# EAGLE design PowerScope_004 (EAGLE 6.1)
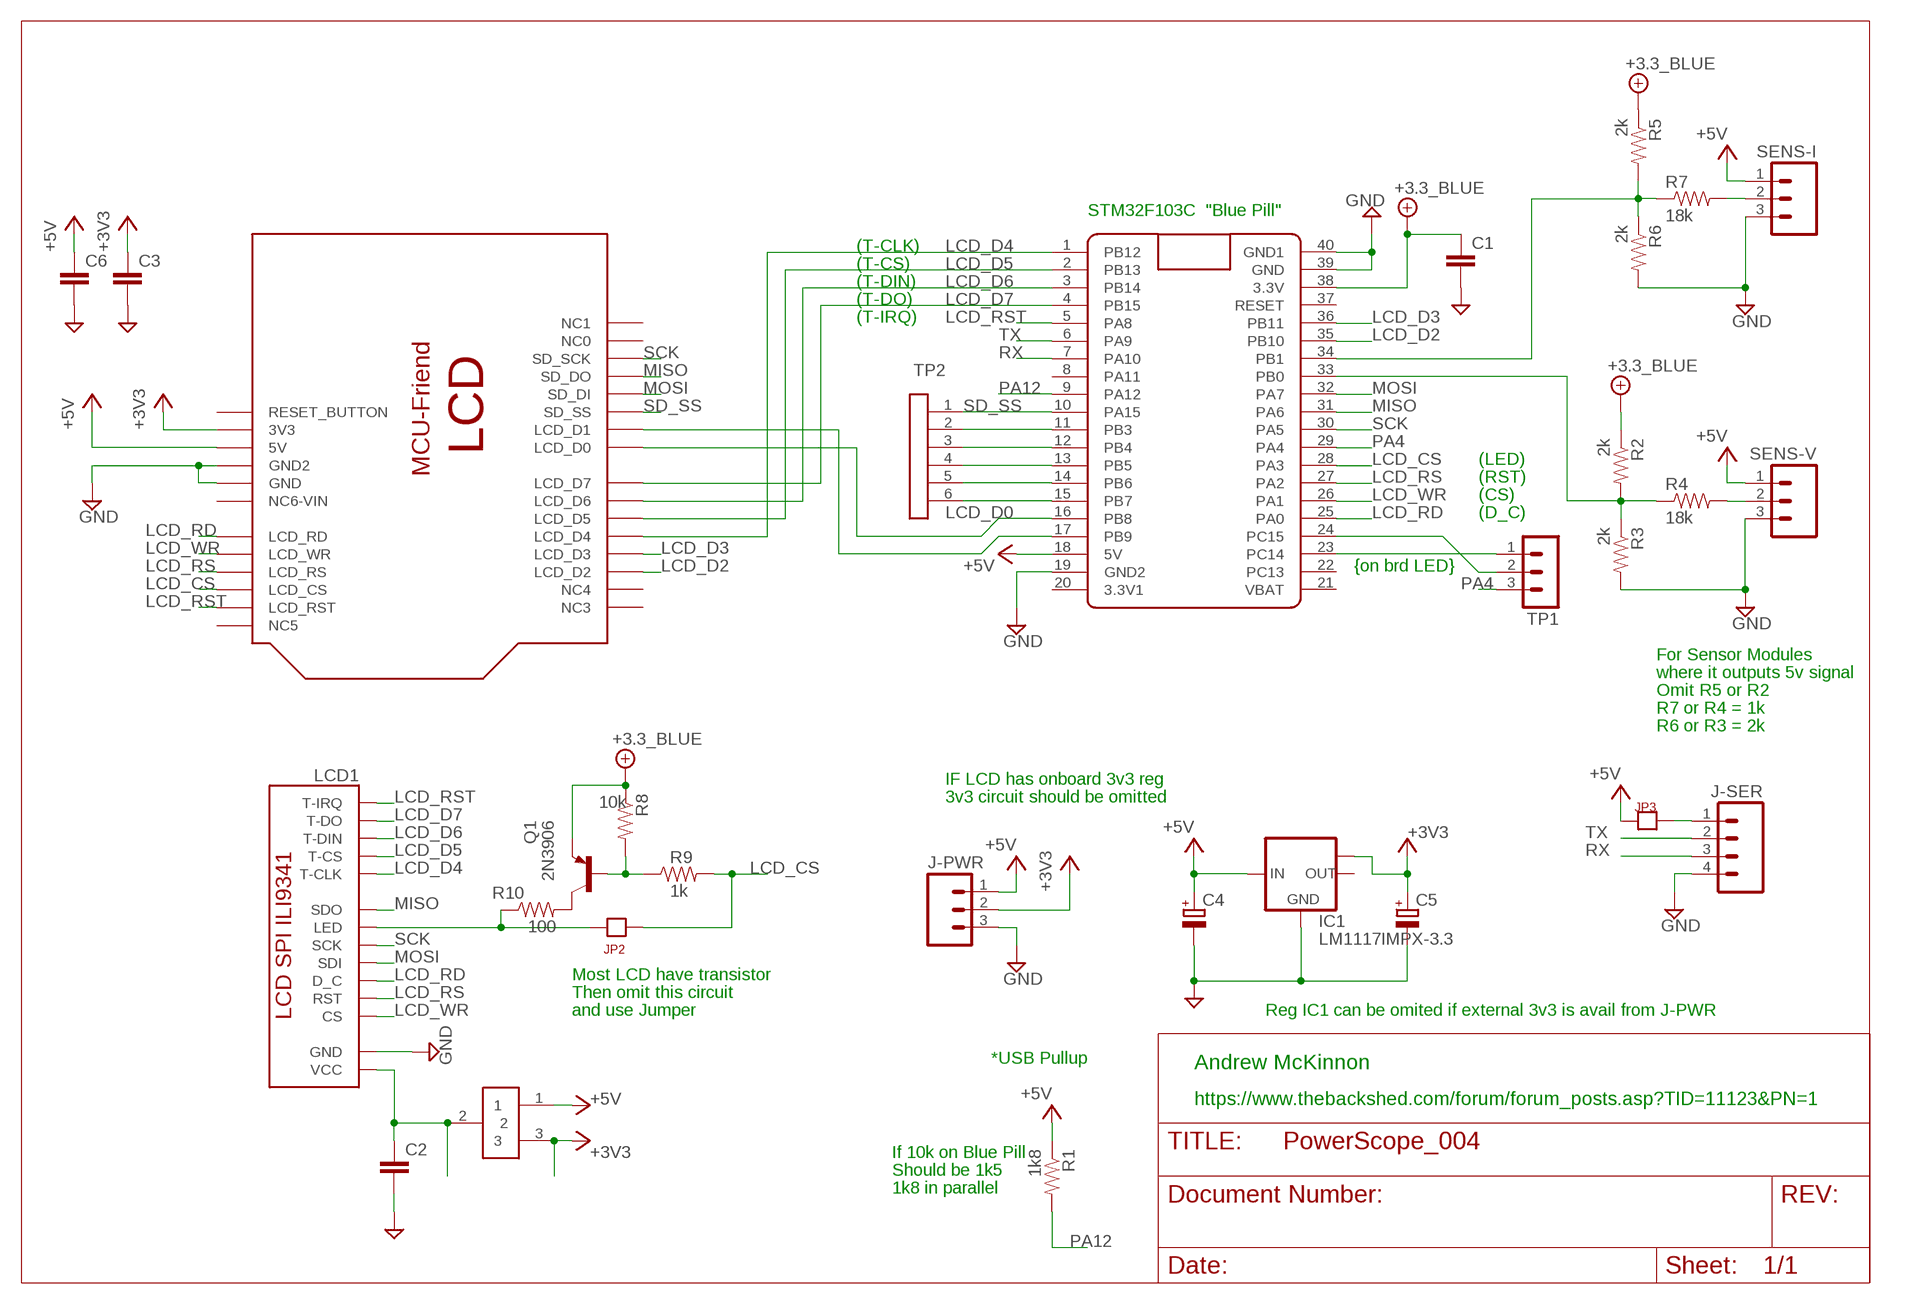
[diagram p0: schematic, sheet 1]

## Parts
C1  BCAP  [BCAP]
C2  BCAP  [BCAP]
C3  BCAP  [BCAP]
C4  C-RB200100  [CPOL-RADIAL-10UF-25V]
C5  C-RB200100  [CPOL-RADIAL-10UF-25V]
C6  BCAP  [BCAP]
IC1  LM1117IMPX-3.3  [SOT223]
J-PWR  MO3POL  [MOLEX-3]
J-SER  MO4POL  [MOLEX-4]
JP1  JP1X3  [JP1X3]
JP2  JP1  [JP1]
JP3  JP1  [JP1]
LCD1  LCD_ILI9341_SPI_TREV  [LCD_ILI9341_SPI_24T_REVERSE]
Q1  2N3906  [TO92]
R1  1k8  R4SMALLPAD  [R4_SP]
R2  2k  R4SMALLPAD  [R4_SP]
R3  2k  R4SMALLPAD  [R4_SP]
R4  18k  R4SMALLPAD  [R4_SP]
R5  2k  R4SMALLPAD  [R4_SP]
R6  2k  R4SMALLPAD  [R4_SP]
R7  18k  R4SMALLPAD  [R4_SP]
R8  10k  R4SMALLPAD  [R4_SP]
R9  1k  R4SMALLPAD  [R4_SP]
R10  100  R4SMALLPAD  [R4_SP]
SENS-I  MO3POL  [MOLEX-3]
SENS-V  MO3POL  [MOLEX-3]
TP1  MA03-1  [MA03-1]
TP2  SIL-6  [SIL6]
U$2  LCD_MCUFRIENDREV  [LCD-MCUFRIEND-24T-REV]
U$3  BLUE_PILL  [BLUE_PILL_CLEAN]

## Nets
+3V3: C3.1 C5.1(+) IC1.TAB(OUT1) J-PWR.2 JP1.3 U$2.3V(3V3)
+5V: C4.1(+) C6.1 IC1.3(IN) J-PWR.1 JP1.1 JP3.1 R1.P$1 SENS-I.1 SENS-V.1 U$2.5V U$3.18(5V)
+UB: C1.1 Q1.3(E) R2.P$1 R5.P$1 R8.P$1 U$3.38(3.3V) ; supply symbol labelled +3.3_BLUE
GND: C1.2 C2.2 C3.2 C4.2(-) C5.2(-) C6.2 IC1.1(GND) J-PWR.3 J-SER.4 LCD1.GND R3.P$2 R6.P$2 SENS-I.3 SENS-V.3 U$2.GND U$2.GND2 U$3.19(GND2) U$3.39(GND) U$3.40(GND1)
LCD_CS: JP2.2 R9.P$2 U$2.LCD_CS U$3.28(PA3)
LCD_D0: U$2.LCD_D0 U$3.16(PB8)
LCD_D2: U$2.LCD_D2 U$3.35(PB10)
LCD_D3: U$2.LCD_D3 U$3.36(PB11)
LCD_D4: LCD1.T_CLK(T-CLK) U$2.LCD_D4 U$3.1(PB12)
LCD_D5: LCD1.T_CS(T-CS) U$2.LCD_D5 U$3.2(PB13)
LCD_D6: LCD1.T_DI(T-DIN) U$2.LCD_D6 U$3.3(PB14)
LCD_D7: LCD1.T_DO(T-DO) U$2.LCD_D7 U$3.4(PB15)
LCD_RD: LCD1.D_C U$2.LCD_RD U$3.25(PA0)
LCD_RS: LCD1.RST U$2.LCD_RS U$3.27(PA2)
LCD_RST: LCD1.T-IRQ U$2.LCD_RST U$3.5(PA8)
LCD_WR: LCD1.CS U$2.LCD_WR U$3.26(PA1)
MISO: LCD1.SDO U$2.SD_DO U$3.31(PA6)
MOSI: LCD1.SDI U$2.SD_DI U$3.32(PA7)
N$1: Q1.2(B) R8.P$2 R9.P$1
N$2: U$2.LCD_D1 U$3.17(PB9)
N$3: Q1.1(C) R10.P$2
N$4: TP1.2 U$3.24(PC15)
N$5: TP2.6 U$3.15(PB7)
N$6: J-SER.1 JP3.2
N$7: R4.P$2 SENS-V.2
N$8: R2.P$2 R3.P$1 R4.P$1 U$3.33(PB0)
N$9: R7.P$2 SENS-I.2
N$10: R5.P$2 R6.P$1 R7.P$1 U$3.34(PB1)
N$11: TP1.1 U$3.23(PC14)
N$12: TP2.5 U$3.14(PB6)
N$13: TP2.4 U$3.13(PB5)
N$14: TP2.3 U$3.12(PB4)
N$15: TP2.2 U$3.11(PB3)
N$16: JP2.1 LCD1.LED R10.P$1
N$17: C2.1 JP1.2 LCD1.VCC
PA4: TP1.3 U$3.29(PA4)
PA12: R1.P$2 U$3.9(PA12)
RX: J-SER.3 U$3.7(PA10)
SCK: LCD1.SCK U$2.SD_SCK U$3.30(PA5)
SD_SS: TP2.1 U$2.SD_SS U$3.10(PA15)
TX: J-SER.2 U$3.6(PA9)
Unconnected: IC1.2(OUT) U$2.NC0 U$2.NC2(NC1) U$2.NC3 U$2.NC4 U$2.NC5 U$2.RESET_BUTTON U$2.VIN(NC6-VIN) U$3.8(PA11) U$3.20(3.3V1) U$3.21(VBAT) U$3.22(PC13) U$3.37(RESET)

## Notes on the sheet
- STM32F103C  "Blue Pill"
- (T-CLK)
- (T-CS)
- (T-DIN)
- (T-DO)
- (T-IRQ)
- (LED)
- (RST)
- (CS)
- (D_C)
- {on brd LED}
- For Sensor Modules
- where it outputs 5v signal
- Omit R5 or R2
- R7 or R4 = 1k
- R6 or R3 = 2k
- IF LCD has onboard 3v3 reg
- 3v3 circuit should be omitted
- Most LCD have transistor
- Then omit this circuit
- and use Jumper | Reg IC1 can be omited if external 3v3 is avail from J-PWR
- *USB Pullup
- Andrew McKinnon
- https://www.thebackshed.com/forum/forum_posts.asp?TID=11123&PN=1
- If 10k on Blue Pill
- Should be 1k5
- 1k8 in parallel

## Library data of the parts
C1-C3 C6 = Andrew Misc:BCAP
C4 C5 = Andrew:C-RB200100
IC1 = lm1117:LM1117IMPX-*
J-PWR SENS-I SENS-V = Andrew_Connectors:MO3POL
J-SER = Andrew_Connectors:MO4POL
JP1 = Andrew_Connectors:JP1X3
JP2 JP3 = Andrew_Connectors:JP1
LCD1 = Andrew_BluePill_Scope:LCD_ILI9341_SPI_T
Q1 = transistor-pnp:2N3906: PNP Transistor
R1-R10 = Andrew Misc:R4
TP1 = con-lstb:MA03-1: PIN HEADER; OC_FARNELL: unknown; OC_NEWARK: unknown
TP2 = Andrew_Connectors:SIL-6
U$2 = Andrew_BluePill_Scope:LCD_MCUFRIEND: Arduino Diecimila/Duemilanove Make a shield with ease, this package has all the named pins as well as the two mounting drill holes and an outline of the USB and DC power connector. The outline is on the DIMENSION layer, so if your board house uses it they will cut the outline to match. http://www.ladyada.net/library/pcb/eaglelibrary.html
U$3 = Andrew_BluePill_Scope:BLUE_PILL

## Board
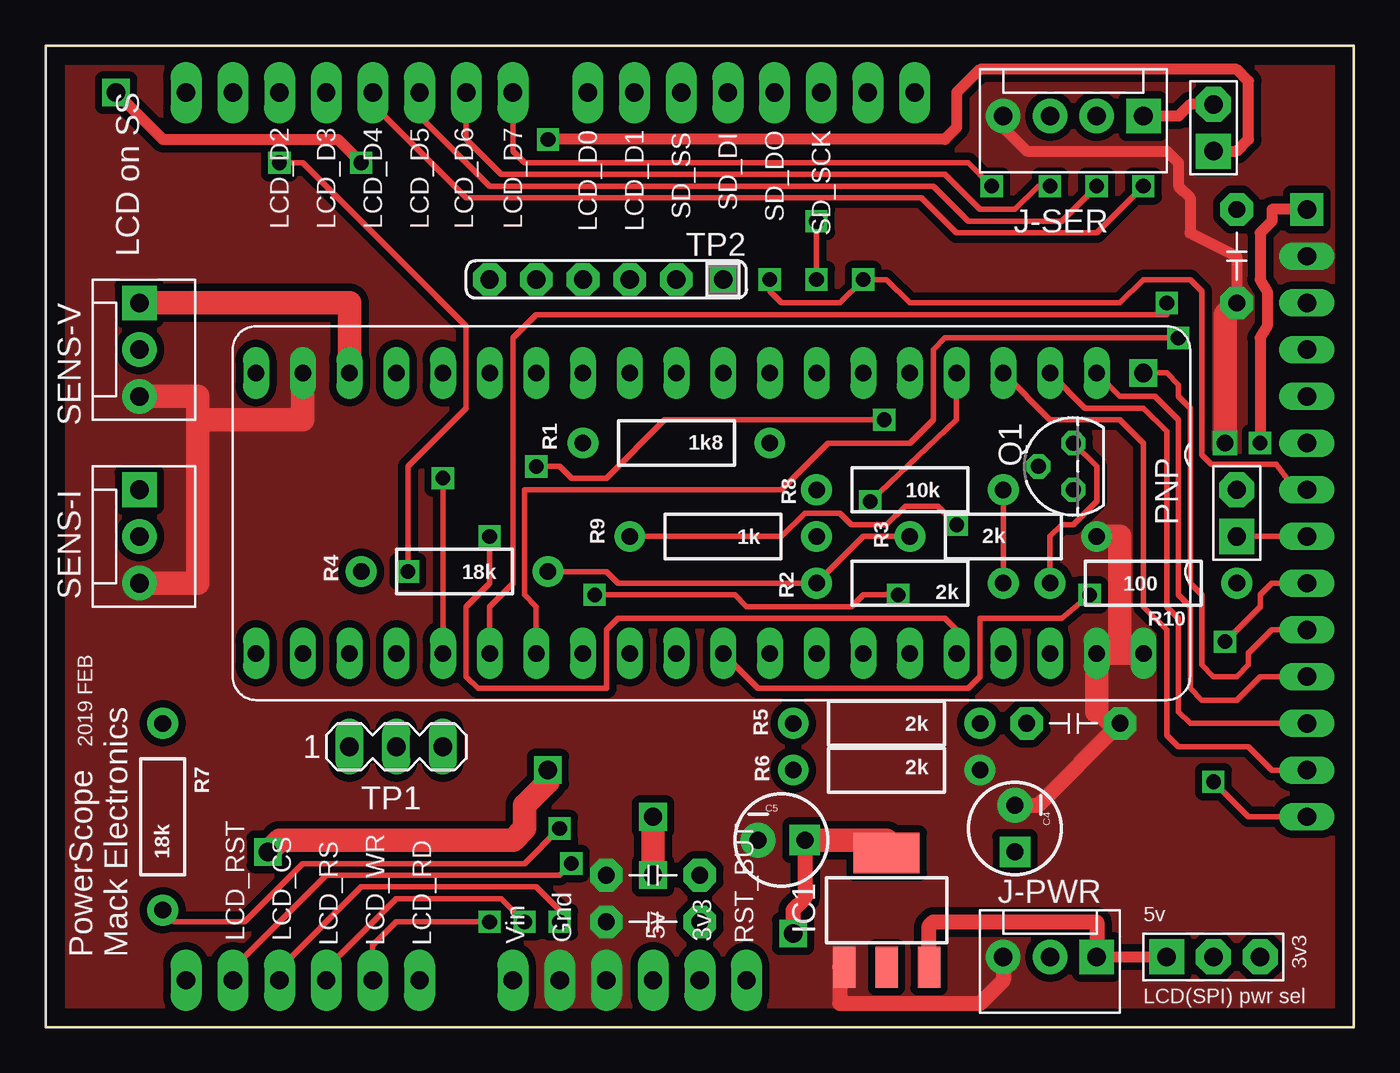
[diagram p1: board, top side]
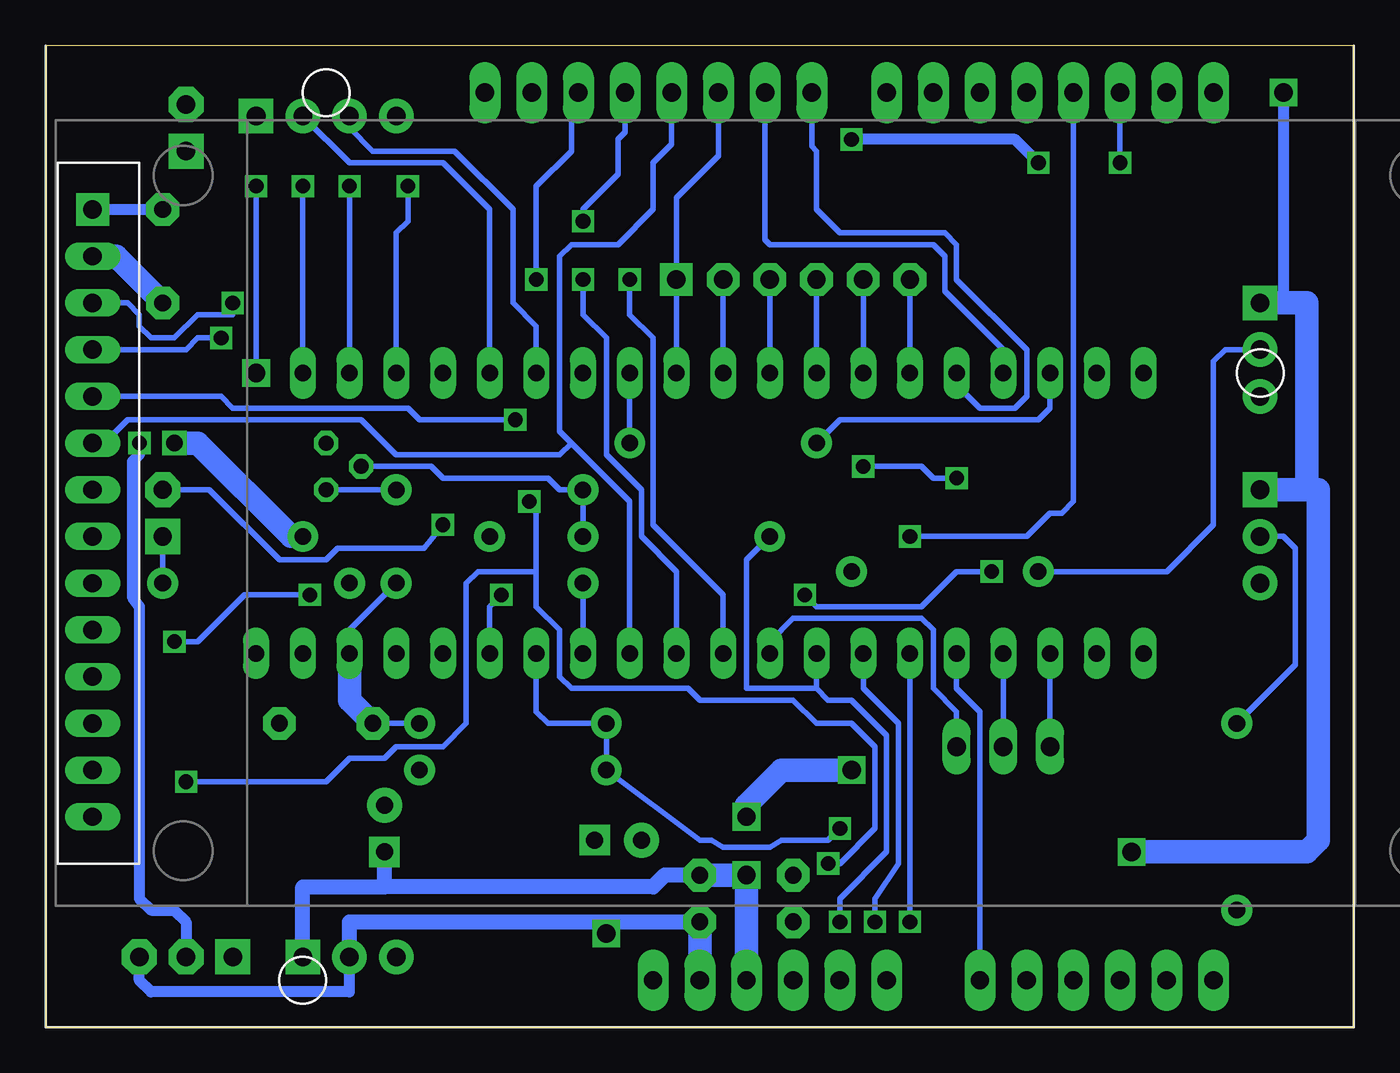
[diagram p2: board, bottom side, seen from below]

Size 71.12 x 53.34 mm. Coordinates in mm from the lower left corner, seen from the top.
Outline: 0,0 0,53.34 71.12,53.34 71.12,0 0,0
Copper layers (1*16): Top 0.035mm / dielectric 1.5mm / Bottom 0.035mm
Design rules: minimum track width 10mil, minimum drill 24mil, track to track 8mil, track to pad 8mil, pad to pad 8mil, via to via 8mil, smd to smd 8mil, copper to edge 40mil, drill to drill 8mil, minimum pad ring 10mil, minimum via ring 8mil, stop-mask expansion 4mil, vias tented up to drill 0mil, thermal gap 10mil

### Footprints (pad centres in the part's own frame; a part is rotated, then mirrored left to right if it is on the bottom)
BCAP = drill 0.914 pad 1.778 octagon: 1 -2.54,0; 2 2.54,0
CPOL-RADIAL-10UF-25V = drill 0.914 pad 1.651 square: 1 1.27,0 | drill 0.914 pad 1.905: 2 -1.27,0
SOT223 = smd 1.219 x 2.235: 1 -2.311,-3.099; 2 0,-3.099; 3 2.311,-3.099 | smd 3.6 x 2.2: TAB 0,3.099
MOLEX-3 = drill 1.016 pad 1.88 square: 1 -2.54,0 | drill 1.016 pad 1.88: 2 0,0; 3 2.54,0
MOLEX-4 = drill 1.016 pad 1.88 square: 1 -3.81,0 | drill 1.016 pad 1.88: 2 -1.27,0; 3 1.27,0; 4 3.81,0
JP1X3 = drill 1 pad 1.905 square: 1 -2.54,0 | drill 1 pad 1.905 octagon: 2 0,0; 3 2.54,0
JP1 = drill 1 pad 1.905 square: 1 -1.27,0 | drill 1 pad 1.905 octagon: 2 1.27,0
LCD_ILI9341_SPI_24T_REVERSE = drill 1 long: CS 0,11.43; D_C 0,6.35; GND 0,13.97; LED 0,-1.27; RST 0,8.89; SCK 0,1.27; SDI 0,3.81; SDO 0,-3.81; T-IRQ 0,-16.51; T_CLK 0,-6.35; T_CS 0,-8.89; T_DI 0,-11.43; T_DO 0,-13.97 | drill 1 pad 1.778 square: VCC 0,16.51
TO92 = drill 0.813 octagon: 1 1.27,0; 2 0,1.905; 3 -1.27,0
R4_SP = drill 0.9 pad 1.676: P$1 0,0; P$2 10.16,0
MA03-1 = drill 1.016 long: 1 -2.54,0; 2 0,0; 3 2.54,0
SIL6 = drill 1 pad 1.778 square: 1 -6.35,0 | drill 1 pad 1.778 octagon: 2 -3.81,0; 3 -1.27,0; 4 1.27,0; 5 3.81,0; 6 6.35,0
LCD-MCUFRIEND-24T-REV = drill 1 pad 1.676 long: 3V 27.94,-48.26; 5V 25.4,-48.26; GND 20.32,-48.26; GND2 22.86,-48.26; LCD_CS 5.08,-48.26; LCD_D0 21.844,0; LCD_D1 24.384,0; LCD_D2 5.08,0; LCD_D3 7.62,0; LCD_D4 10.16,0; LCD_D5 12.7,0; LCD_D6 15.24,0; LCD_D7 17.78,0; LCD_RD 12.7,-48.26; LCD_RS 7.62,-48.26; LCD_RST 2.54,-48.26; LCD_WR 10.16,-48.26; NC0 0,0; NC2 2.54,0; NC3 39.624,0; NC4 37.084,0; NC5 0,-48.26; RESET_BUTTON 30.48,-48.26; SD_DI 29.464,0; SD_DO 32.004,0; SD_SCK 34.544,0; SD_SS 26.924,0; VIN 17.78,-48.26
BLUE_PILL_CLEAN = drill 1 square: 1 0,0 | drill 0.9 long: 2 0,-2.54; 3 0,-5.08; 4 0,-7.62; 5 0,-10.16; 6 0,-12.7; 7 0,-15.24; 8 0,-17.78; 9 0,-20.32; 10 0,-22.86; 11 0,-25.4; 12 0,-27.94; 13 0,-30.48; 14 0,-33.02; 15 0,-35.56; 16 0,-38.1; 17 0,-40.64; 18 0,-43.18; 19 0,-45.72; 20 0,-48.26; 21 15.24,-48.26; 22 15.24,-45.72; 23 15.24,-43.18; 24 15.24,-40.64; 25 15.24,-38.1; 26 15.24,-35.56; 27 15.24,-33.02; 28 15.24,-30.48; 29 15.24,-27.94; 30 15.24,-25.4; 31 15.24,-22.86; 32 15.24,-20.32; 33 15.24,-17.78; 34 15.24,-15.24; 35 15.24,-12.7; 36 15.24,-10.16; 37 15.24,-7.62; 38 15.24,-5.08; 39 15.24,-2.54; 40 15.24,0

### Placement (x,y rotation side)
C1  55.88,16.51 0 top
C2  64.77,41.91 270 top
C3  33.02,5.71 180 top
C4  52.7,10.79 270 top
C5  40.01,10.16 0 top
C6  33.02,8.26 180 top
IC1  45.72,6.35 0 top
J-PWR  54.61,3.81 180 top
J-SER  55.88,49.53 180 top
JP1  63.5,3.81 0 top
JP2  64.77,27.94 90 top
JP3  63.5,48.9 90 top
LCD1  68.58,27.94 0 top
Q1  55.88,30.48 90 top
R1  29.21,31.75 0 top
R2  52.07,24.13 180 top
R3  46.99,26.67 0 top
R4  27.3,24.77 180 top
R5  50.8,16.51 180 top
R6  40.64,13.97 0 top
R7  6.35,6.35 90 top
R8  52.07,29.21 180 top
R9  41.91,26.67 180 top
R10  64.77,24.13 180 top
SENS-I  5.08,26.67 270 top
SENS-V  5.08,36.83 270 top
TP1  19.05,15.24 0 top
TP2  30.48,40.64 180 top
U$2  7.62,50.8 0 top
U$3  59.69,35.56 270 top

### Tracks (layer width: path | path; a pad name or v marks a point on that pad's centre or on a via)
+3V3  (via drill 1)
  Top 0.813: C5.1 41.27,6.99 40.64,6.35 v40.64,5.08
  Top 1.27: IC1.TAB 45.72,10.16 C5.1
  Bottom 0.61: J-PWR.2 54.61,1.91 65.41,1.91 66.04,2.54 JP1.3
  Bottom 0.813: J-PWR.2 54.61,5.71 40.64,5.71 | 40.64,5.71 C3.1 | v40.64,5.08 40.64,5.71
  Bottom 1.27: U$2.3V C3.1
+5V  (via drill 0.8, 1)
  Top 0.61: JP3.1 64.77,47.62 65.41,48.26 65.41,51.44 64.77,52.07 50.8,52.07 49.53,50.8 49.53,48.9 48.9,48.26 v27.3,48.26 | v3.81,50.8 6.35,48.26 15.88,48.26 v17.14,46.99 | J-PWR.1 JP1.1
  Top 0.813: J-PWR.1 57.15,5.71 48.26,5.71 48.03,5.49 IC1.3 | IC1.3
  Top 1.27: U$3.18 16.51,39.37 SENS-V.1 | v33.02,8.26 v33.02,11.43 | v12.06,9.53 12.7,10.16 25.4,10.16 26.04,10.79 26.04,12.06 27.3,13.34 v27.3,13.97
  Bottom 0.305: R1.P$1 27.94,33.02 17.14,33.02 16.51,33.66 U$3.18
  Bottom 0.61: v3.81,50.8 3.81,39.37 | v17.14,46.99 18.41,48.26 v27.3,48.26
  Bottom 0.813: C6.1 37.47,8.26 38.1,7.62 52.7,7.62 | 52.7,7.62 57.15,7.62 J-PWR.1 | 52.7,7.62 C4.1
  Bottom 1.27: U$2.5V v33.02,8.26 C6.1 | SENS-V.1 3.81,39.37 2.54,39.37 2.54,29.21 SENS-I.1 1.91,29.21 1.91,10.16 2.54,9.53 v12.06,9.53 | v33.02,11.43 33.02,12.06 31.11,13.97 v27.3,13.97
+UB
  Top 0.305: R2.P$1 R8.P$1
  Bottom 0.305: C1.1 R5.P$1 | U$3.38 54.61,21.59 R2.P$1 | R8.P$1 Q1.3
  Bottom 1.27: C1.1 54.61,17.78 U$3.38
GND  (via drill 0.9)
  Top 0.61: J-SER.4 52.07,48.9 53.34,47.62 60.96,47.62 61.59,46.99 61.59,45.72 62.23,45.09 62.23,43.18 64.77,41.91 C2.2
  Top 0.813: J-PWR.3 52.07,2.54 50.8,1.27 43.18,1.27 43.18,3.25 IC1.1 | C4.2 53.98,12.06 C1.2 57.78,16.51 57.15,17.14
  Top 1.27: U$3.19 13.97,33.02 8.26,33.02 | 8.26,33.02 8.26,34.29 SENS-V.3 | SENS-I.3 8.26,24.13 8.26,33.02 | 57.15,17.14 U$3.39 58.42,20.32 | 58.42,20.32 U$3.40 | v64.14,31.75 64.14,38.73 C2.2 | R3.P$2 58.42,26.67 58.42,20.32
  Bottom 1.27: R3.P$2 57.78,26.67 62.87,31.75 v64.14,31.75 | LCD1.GND 67.31,41.91 C2.2
  pour Top (isolate 0.406, no thermals): 0.64,52.7 70.48,52.7 70.48,0.64 1.27,0.64 0.64,1.27
LCD_CS  (via drill 0.8)
  Top 0.305: U$2.LCD_CS 12.7,3.17 17.14,7.62 26.67,7.62 27.94,6.35 v27.94,5.71 | v49.53,27.3 48.51,28.32 46.74,28.32 45.72,27.3 43.81,27.3 43.18,27.94 41.27,27.94 40.01,26.67 R9.P$2
  Bottom 0.305: v27.94,5.71 27.94,6.99 25.4,9.53 25.4,15.88 27.3,17.78 28.57,17.78 29.21,18.41 | U$3.28 29.21,18.41 | R9.P$2 33.02,25.4 33.02,18.41 29.21,18.41 | JP2.2 62.23,29.21 58.42,25.4 55.88,25.4 55.24,26.04 50.55,26.04 v49.53,27.3
LCD_D0
  Bottom 0.305: U$2.LCD_D0 29.46,47.88 29.21,47.62 29.21,44.45 27.94,43.18 22.23,43.18 21.59,42.55 21.59,40.64 17.78,36.83 17.78,34.29 18.41,33.66 20.32,33.66 21.59,34.92 U$3.16
LCD_D2  (via drill 0.8)
  Top 0.305: v46.35,23.5 44.45,23.5 43.81,22.86 38.1,22.86 37.47,23.5 v29.84,23.5 | v12.7,46.99 13.97,46.99 22.86,38.1 22.86,33.66 19.68,30.48 v19.68,24.77
  Bottom 0.305: U$3.35 46.99,22.86 v46.35,23.5 | U$2.LCD_D2 v12.7,46.99 | v19.68,24.77 21.59,24.77 23.5,22.86 29.21,22.86 v29.84,23.5
LCD_D3  (via drill 0.8)
  Top 0.305: U$3.36 49.53,21.59 48.9,22.23 31.11,22.23 30.48,21.59 30.48,18.41 23.5,18.41 22.86,19.05 22.86,22.86 24.13,24.13 v24.13,26.67
  Bottom 0.305: U$2.LCD_D3 15.24,28.57 15.88,27.94 16.51,27.94 17.78,26.67 v24.13,26.67
LCD_D4  (via drill 0.8)
  Top 0.305: U$2.LCD_D4 17.78,50.16 22.86,45.09 47.62,45.09 49.53,43.18 57.15,43.18 v59.69,45.72 | LCD1.T_CLK 66.67,21.59 65.41,20.32 65.41,19.68 64.77,19.05 63.5,19.05 62.87,19.68 62.87,23.5 62.23,24.13 62.23,33.66 61.59,34.29 61.59,34.92 60.96,35.56 U$3.1
  Bottom 0.305: v59.69,45.72 U$3.1
LCD_D5  (via drill 0.8)
  Top 0.305: U$2.LCD_D5 20.32,49.53 24.13,45.72 48.26,45.72 50.16,43.81 55.24,43.81 v57.15,45.72 | LCD1.T_CS 66.04,19.05 64.77,17.78 62.87,17.78 62.23,18.41 62.23,22.86 61.59,23.5 61.59,33.02 60.33,34.29 58.42,34.29 U$3.2
  Bottom 0.305: v57.15,45.72 U$3.2
LCD_D6  (via drill 0.8)
  Top 0.305: U$2.LCD_D6 22.86,48.26 24.77,46.35 48.9,46.35 50.8,44.45 52.7,44.45 53.98,45.72 v54.61,45.72 | LCD1.T_DI 62.23,16.51 61.59,17.14 61.59,22.23 60.96,22.86 60.96,32.38 59.69,33.66 56.52,33.66 U$3.3
  Bottom 0.305: v54.61,45.72 U$3.3
LCD_D7  (via drill 0.8)
  Top 0.305: LCD1.T_DO 66.67,13.97 65.41,15.24 61.59,15.24 60.96,15.88 60.96,21.59 59.69,22.86 59.69,31.75 58.42,33.02 54.61,33.02 U$3.4 | U$2.LCD_D7 25.4,47.62 26.04,46.99 50.16,46.99 v51.44,45.72
  Bottom 0.305: v51.44,45.72 51.44,43.81 52.07,43.18 U$3.4
LCD_RD  (via drill 0.8)
  Top 0.305: U$3.25 v21.59,29.84 | v45.59,33.02 33.66,33.02 30.48,29.84 28.57,29.84 27.94,30.48 v26.67,30.48
  Bottom 0.305: U$2.LCD_RD 20.32,17.14 21.59,18.41 U$3.25 | LCD1.D_C 61.59,34.29 60.96,33.66 51.44,33.66 50.8,33.02 v45.59,33.02 | v26.67,30.48 23.5,30.48 22.86,29.84 v21.59,29.84
LCD_RS  (via drill 0.8)
  Top 0.305: U$2.LCD_RS 15.24,3.17 19.05,6.99 24.77,6.99 v26.04,5.71 | U$3.27 26.67,22.86 26.04,23.5 26.04,29.21 40.01,29.21 42.55,31.75 46.99,31.75 48.26,33.02 48.26,36.83 48.9,37.47 v61.59,37.47
  Bottom 0.305: v26.04,5.71 26.04,6.99 24.77,8.89 24.77,16.51 26.67,18.41 U$3.27 | LCD1.RST 63.5,36.83 62.87,37.47 v61.59,37.47
LCD_RST  (via drill 0.8)
  Top 0.305: U$2.LCD_RST 10.16,3.17 15.24,8.26 27.94,8.26 v28.57,8.89 | v44.83,28.57 49.53,33.02 U$3.5 | v63.5,13.34 65.41,11.43 LCD1.T-IRQ
  Bottom 0.305: v28.57,8.89 27.94,8.89 26.04,10.79 26.04,15.24 27.3,16.51 29.21,16.51 30.48,17.78 35.56,17.78 36.2,18.41 42.55,18.41 43.18,19.05 43.18,21.59 44.45,22.86 44.45,24.77 | 44.45,24.77 44.45,27.94 v44.83,28.57 | v63.5,13.34 55.88,13.34 54.61,14.61 52.7,14.61 52.07,15.24 49.53,15.24 48.26,16.51 48.26,24.13 47.62,24.77 44.45,24.77
LCD_WR  (via drill 0.8)
  Top 0.305: U$2.LCD_WR 17.78,4.45 19.05,5.71 v24.13,5.71 | U$3.26 24.13,22.86 25.4,24.13 25.4,37.47 26.67,38.73 60.96,38.73 v60.96,39.37
  Bottom 0.305: U$3.26 v24.13,5.71 | LCD1.CS 66.67,39.37 66.04,38.73 66.04,38.1 65.41,37.47 64.14,37.47 62.87,38.73 60.96,38.73 v60.96,39.37
MISO  (via drill 0.8)
  Top 0.305: v56.77,23.5 55.24,22.23 50.8,22.23 50.8,19.05 50.16,18.41 38.73,18.41 U$3.31 | v41.91,40.64 v41.91,43.81 | v64.14,20.95 66.04,22.86 66.04,23.5 66.67,24.13 LCD1.SDO
  Bottom 0.305: U$2.SD_DO 39.62,48.64 40.01,48.26 40.01,46.35 41.91,44.45 v41.91,43.81 | U$3.31 36.83,24.77 38.73,26.67 38.73,29.21 40.64,31.11 40.64,37.47 41.91,38.73 v41.91,40.64 | v56.77,23.5 60.33,23.5 62.87,20.95 v64.14,20.95
MOSI
  Bottom 0.305: U$2.SD_DI 37.08,48.01 38.1,46.99 38.1,44.45 40.01,42.55 42.55,42.55 43.18,41.91 43.18,32.38 42.55,31.75 | U$3.32 39.37,28.57 42.55,31.75 | 42.55,31.75 43.18,31.11 52.07,31.11 53.98,33.02 66.67,33.02 67.94,31.75 LCD1.SDI
N$1
  Bottom 0.305: R9.P$1 R8.P$2 43.18,29.21 43.81,29.84 49.53,29.84 50.16,30.48 Q1.2
N$2
  Bottom 0.305: U$3.17 19.05,36.83 22.23,40.01 22.23,41.91 22.86,42.55 31.75,42.55 32,42.8 U$2.LCD_D1
N$3
  Top 0.305: R10.P$2 54.61,26.67 55.24,27.3 55.88,27.3 57.15,28.57 57.15,30.48 Q1.1
N$4
  Bottom 0.305: TP1.2 U$3.24
N$5
  Bottom 0.305: U$3.15 TP2.6
N$6
  Top 0.61: JP3.2 62.23,50.16 61.59,49.53 J-SER.1
N$7
  Bottom 0.305: R4.P$2 10.16,24.77 7.62,27.3 7.62,36.2 6.99,36.83 SENS-V.2
N$8
  Top 0.305: R4.P$1 30.48,24.77 31.11,24.13 R2.P$2 44.45,26.67 R3.P$1
  Bottom 0.305: U$3.33 R2.P$2
N$9
  Bottom 0.305: SENS-I.2 3.81,26.67 3.17,26.04 3.17,19.68 R7.P$2
N$10  (via drill 0.8)
  Top 0.305: v27.94,10.79 26.04,8.89 13.97,8.89 10.79,5.71 6.99,5.71 R7.P$1
  Bottom 0.305: U$3.34 44.45,17.14 43.81,16.51 R5.P$2 R6.P$1 35.56,10.16 34.92,10.16 34.29,9.78 31.75,9.78 31.11,10.16 28.57,10.16 v27.94,10.79
N$11
  Bottom 0.305: TP1.1 U$3.23
N$12
  Bottom 0.305: U$3.14 TP2.5
N$13
  Bottom 0.305: U$3.13 TP2.4
N$14
  Bottom 0.305: U$3.12 TP2.3
N$15
  Bottom 0.305: U$3.11 TP2.2
N$16
  Top 0.305: JP2.1 LCD1.LED
  Bottom 0.305: R10.P$1 JP2.1
N$17  (via drill 0.8)
  Top 0.61: LCD1.VCC 66.67,44.45 66.67,43.81 66.04,43.18 66.04,40.64 66.42,40.01 66.42,38.1 66.04,37.47 v66.04,31.75
  Bottom 0.61: LCD1.VCC C2.1 | v66.04,31.75 66.04,31.11 66.42,30.73 66.42,23.37 66.04,22.86 66.04,6.99 65.41,6.35 64.14,6.35 63.5,5.71 JP1.2
PA4
  Bottom 0.305: TP1.3 21.59,17.14 22.86,18.41 22.86,21.59 23.5,22.23 30.48,22.23 31.75,20.95 U$3.29
PA12
  Bottom 0.305: R1.P$2 U$3.9
RX
  Bottom 0.305: J-SER.3 54.61,48.9 53.34,47.62 48.9,47.62 45.72,44.45 45.72,39.37 44.45,38.1 U$3.7
SCK  (via drill 0.8)
  Top 0.305: LCD1.SCK 67.94,29.21 66.93,30.61 63.37,30.61 62.87,31.11 62.87,40.01 62.23,40.64 59.69,40.64 58.42,39.37 46.99,39.37 45.72,40.64 v44.45,40.64 43.18,39.37 40.01,39.37 39.37,40.01 v39.37,40.64
  Bottom 0.305: U$3.30 34.29,23.5 38.1,27.3 38.1,37.47 39.37,38.73 v39.37,40.64 | U$2.SD_SCK 42.55,50.42 42.55,47.62 44.45,45.72 v44.45,40.64
SD_SS
  Bottom 0.305: U$3.10 TP2.1 36.83,45.09 34.54,47.37 U$2.SD_SS
TX
  Bottom 0.305: J-SER.2 54.61,46.99 49.53,46.99 46.99,44.45 U$3.6

### Text on the board
tPlace: PNP | 2019 FEB | 5v | PowerScope | Mack Electronics | 3v3 | LCD(SPI) pwr sel